# Altium schematic sheet Sheet1.SchDoc
size A; SheetNumber: 1; SheetTotal: 1
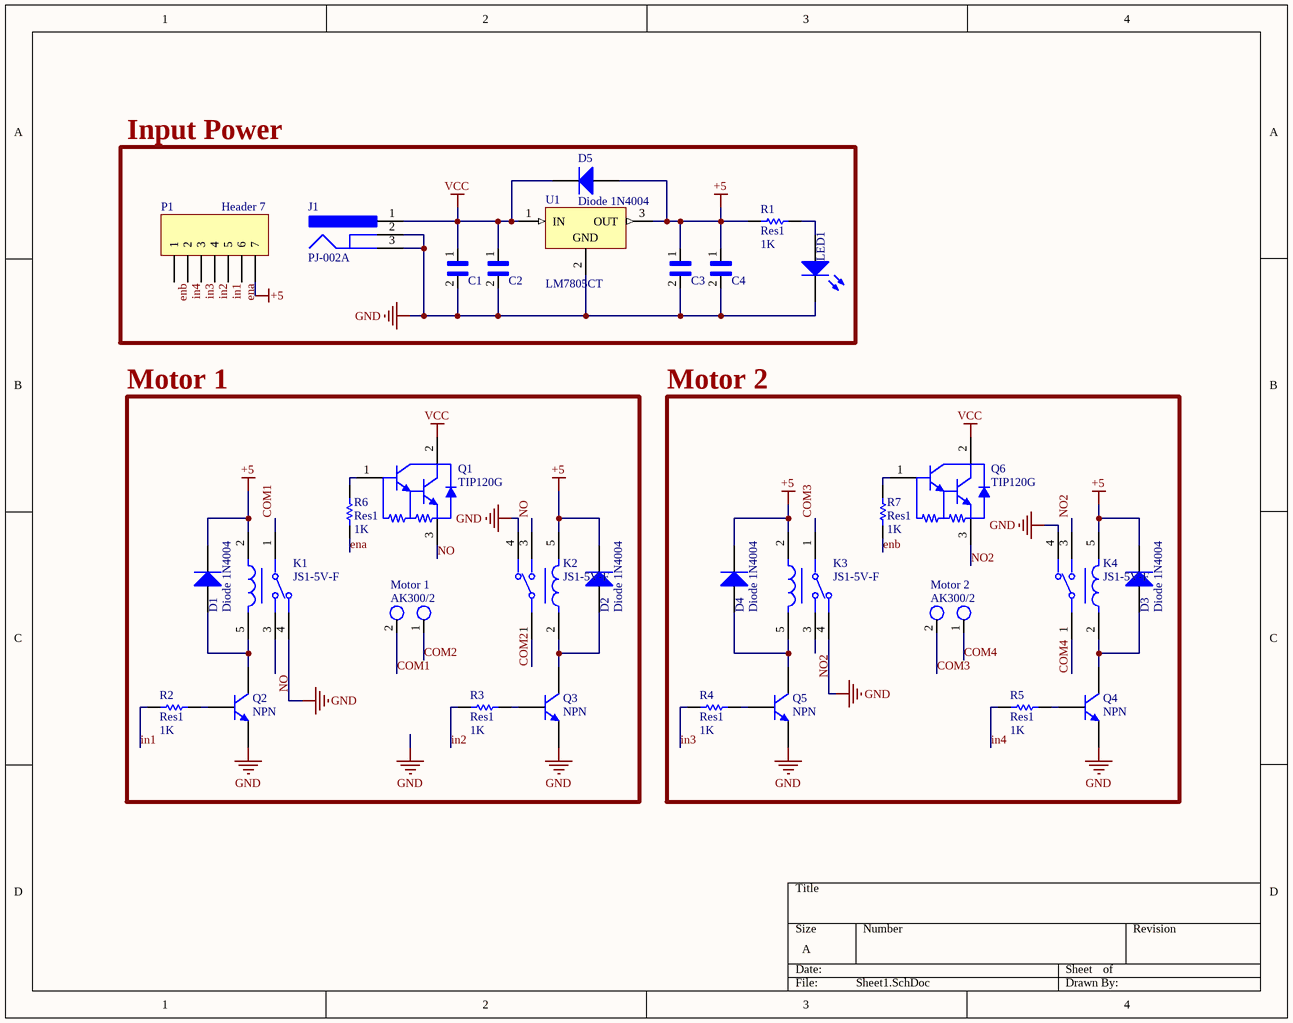
[diagram p0: Sheet1.SchDoc]

## Parts
C1  RDE5C2A220J0M1H03A  [CAP_RDE5C2A220J0M1H03A]  (value not drawn)
C2  RDE5C2A220J0M1H03A  [CAP_RDE5C2A220J0M1H03A]  (value not drawn)
C3  RDE5C2A220J0M1H03A  [CAP_RDE5C2A220J0M1H03A]  (value not drawn)
C4  RDE5C2A220J0M1H03A  [CAP_RDE5C2A220J0M1H03A]  (value not drawn)
D1  Diode 1N4004  [DO-41]
D2  Diode 1N4004  [DO-41]
D3  Diode 1N4004  [DO-41]
D4  Diode 1N4004  [DO-41]
D5  Diode 1N4004  [DO-41]
J1  PJ-002A  [CUI-PJ-002A_V]
K1  JS1-5V-F  [FP-JS1-5V-F-MFG]
K2  JS1-5V-F  [FP-JS1-5V-F-MFG]
K3  JS1-5V-F  [FP-JS1-5V-F-MFG]
K4  JS1-5V-F  [FP-JS1-5V-F-MFG]
LED1  151031SS06000  [Type 3mm]  (value not drawn)
Motor_1  AK300/2  [AK300/2]
Motor_2  AK300/2  [AK300/2]
P1  Header 7  [HDR1X7]
Q1  TIP120G  [ONSC-TO-220-3-221A-09]
Q2  NPN  [TO-226-AA]
Q3  NPN  [TO-226-AA]
Q4  NPN  [TO-226-AA]
Q5  NPN  [TO-226-AA]
Q6  TIP120G  [ONSC-TO-220-3-221A-09]
R1  Res1  value 1K  [AXIAL-0.3]
R2  Res1  value 1K  [AXIAL-0.3]
R3  Res1  value 1K  [AXIAL-0.3]
R4  Res1  value 1K  [AXIAL-0.3]
R5  Res1  value 1K  [AXIAL-0.3]
R6  Res1  value 1K  [AXIAL-0.3]
R7  Res1  value 1K  [AXIAL-0.3]
U1  LM7805CT  [FAIR-TO-220-3]

## Blocks framed on the sheet
Input Power: C1-C4 D5 J1 LED1 P1 R1 U1
Motor 1: D1 D2 K1 K2 Motor_1 Q1-Q3 R2 R3 R6
Motor 2: D3 D4 K3 K4 Motor_2 Q4-Q6 R4 R5 R7

## Nets
+5: C3.1 C4.1 D1.2(K) D2.2(K) D3.2(K) D4.2(K) D5.1(A) K1.2(1_COIL) K2.5(2_COIL) K3.2(1_COIL) K4.5(2_COIL) P1.7 R1.1 U1.3(OUT)
GND: C1.2 C2.2 C3.2 C4.2 J1.2 J1.3 K1.4(N.C.) K2.4(N.C.) K3.4(N.C.) K4.4(N.C.) LED1.1(K) Q2.3(E) Q3.3(E) Q4.3(E) Q5.3(E) U1.2(GND)
VCC: C1.1 C2.1 D5.2(K) J1.1 Q1.2(C) Q6.2(C) U1.1(IN)
COM1: K1.1(COM) Motor_1.2(KL)
COM2: K2.1(COM) Motor_1.1(KL)
COM3: K3.1(COM) Motor_2.2(KL)
COM4: K4.1(COM) Motor_2.1(KL)
ena: P1.6 R6.1
enb: P1.1 R7.1
in1: P1.5 R2.1
in2: P1.4 R3.1
in3: P1.3 R4.1
in4: P1.2 R5.1
NO: K1.3(N.O.) K2.3(N.O.) Q1.3(E)
NO2: K3.3(N.O.) K4.3(N.O.) Q6.3(E)
NetD1_1: D1.1(A) K1.5(2_COIL) Q2.1(C)
NetD2_1: D2.1(A) K2.2(1_COIL) Q3.1(C)
NetD3_1: D3.1(A) K4.2(1_COIL) Q4.1(C)
NetD4_1: D4.1(A) K3.5(2_COIL) Q5.1(C)
NetLED1_2: LED1.2(A) R1.2
NetQ1_1: Q1.1(B) R6.2
NetQ2_2: Q2.2(B) R2.2
NetQ3_2: Q3.2(B) R3.2
NetQ4_2: Q4.2(B) R5.2
NetQ5_2: Q5.2(B) R4.2
NetQ6_1: Q6.1(B) R7.2

## Library data of the parts
C1-C4 = RDE5C2A220J0M1H03A: Lead Capacitor C0G_EIA_ with Capacitance: 22pF and Rated Voltage: 100Vdc; MF: Murata; Availability: Unavailable; Price: None; Package: Radial Murata; Value: *; SnapEDA_Link: https://www.snapeda.com/parts/RDE5C2A220J0M1H03A/Murata/view-part/4545539/?ref=snap; MP: RDE5C2A220J0M1H03A
D1-D5 = Diode 1N4004: 1 Amp General Purpose Rectifier; Published: 8-Jun-2000; LatestRevisionDate: 17-Jul-2002; LatestRevisionNote: Re-released for DXP Platform.; DatasheetVersion: 1998; PackageVersion: Aug-1999; PackageReference: DO-41; Publisher: Altium Limited; PackageDescription: Diode, Axial; Body 5.2 x 2.7 mm (LxDia. max), Lead Dia. 0.86 mm (max); Code_JEDEC: DO-204-AL; ComponentLink1Description: Manufacturer Link; ComponentLink1URL: http://www.fairchildsemi.com/; ComponentLink2Description: Datasheet; ComponentLink2URL: http://www.fairchildsemi.com/ds/1N%2F1N4001.pdf
J1 = CMP-2000-06895-1: Through Hole Right Angle DC Power Jack, 2.5 A, 2 mm Center Pin, 3 Position, -25 to 85 degC, RoHS, Bulk; Manufacturer: CUIInc.; Current Rating: 2.5A; Inside Contact Diameter: 2mm; Insulation Resistance: 50MOhms; Outside Contact Diameter: 6.5mm; Voltage Rating: 24V; Brand: CUI; Operating Temperature Range: -25Cto+85C; Mounting Technology: ThroughHole; Connector Type: DCPowerJack; Contact Material: Copper; Datasheet URL: http://www.cui.com/product/resource/pj-002a.pdf; Contact Gender: Male; Housing Material: PolybutyleneTerephthalate(PBT); Manufacturer URL: http://www.cui.com/; Package Reference: PJ-002A; Mounting Style: ThroughHole; Mounting Angle: Right; Product Category: DCPowerConnectors; Product: Jacks; Flammability Rating: UL94V-0; Contact Plating: Nickel; RoHS: True; Datasheet Version: Rev. 1.03, 04/2016; Package Description: 3-Pin Through Hole Device, Body 14.4 x 9 mm, Height 11 mm; Factory Pack Quantity: 500; Termination Style: ThroughHole
K1-K4 = CMP-05606-000016-1: RELAY GEN PURPOSE SPDT 10A 5V; Manufacturer: Panasonic; Coil Type: Non-Latching; Number Of Contacts: 1; Standoff Height: 0.3mm; Switching Power: 150W; Coil Power: 360mW; Coil Current: 72mA; Coil Resistance: 69.4Ω; Lead Free: Yes; Device Class L3: Power Relays; Device Class L1: Electromechanical; Ambient Temperature Range High: +70°C; Temperature: -40°C to +70°C; Temperature Range High: +70°C; Temperature Range Low: -40°C; Manufacturer Part Number: JS1-5V-F; Coil Voltage: 5V; Switching Current: 10A; Digikey Description: RELAY GEN PURPOSE SPDT 10A 5V; Device Class L2: Relays; Ambient Temperature Range Low: -40°C; Throw Configuration: SPDT; Category: Relay; ComponentLink2URL: https://www3.panasonic.biz/ac/e_download/control/relay/power/catalog/mech_eng_js.pdf?via=ok; Package: JS1-5V-F; Octopart: https://octopart.com/js1-5v-f-panasonic-39428621; Mouser Description: JS Series 10 A SPDT 5 V Through Hole Sealed Miniature Non-Polarized Power Relay; Height: 16.8mm; ComponentLink2Description: Datasheet; RoHS: TRUE; Automotive: No
LED1 = CMP-1488-00002-1: THT LED round mono-color color lens, WL-TMRW, Super Red; Manufacturer: Wuerth Elektronik; ComponentLink2URL: http://katalog.we-online.de/pbs/datasheet/7448042001.pdfhttp://katalog.we-online.de/pbs/datasheet/7448042001.pdfhttp://katalog.we-online.de/pbs/datasheet/7448042001.pdfhttp://katalog.we-online.de/pbs/datasheet/151031SS06000.pdf; ComponentLink1URL: http://www.we-online.com; PartNumber: 151031SS06000; ComponentLink2Description: Datasheet; PackageReference: Type 3mm; Emitting color: Super Red; ComponentLink1Description: Manufacturer URL
Motor_1 Motor_2 = AK300/2: MP: AK300/3; MF: Altech; Package: None; Availability: Unavailable; SnapEDA_Link: https://www.snapeda.com/parts/AK300/3/Altech/view-part/2748485/?ref=snap; Check_prices: https://www.snapeda.com/parts/AK300/3/Altech/view-part/2748485/?ref=eda; Value: *; Price: None
P1 = Header 7: Header, 7-Pin; LatestRevisionDate: 17-Jul-2002; LatestRevisionNote: Re-released for DXP Platform.; Publisher: Altium Limited
Q1 Q6 = CMP-1047-00134-1: Plastic Medium-Power, Complementary Silicon Transistor, 3-Pin TO-220, Pb-Free, Tube; Manufacturer: On Semiconductor; Polarity: NPN; IC Continuous (A): 5; PackageDescription: 3-Pin Flange Mount, Vertical Straight Lead, Body 9.97 x 4.445 mm, Pitch 2.54 mm; PackageVersion: Rev. AG, 09/2011; ComponentLink2Description: Datasheet; DatasheetVersion: Rev. 8; Mounting Technology: Through Hole; ComponentLink1URL: http://www.onsemi.com/; RoHS: TRUE; ComponentLink3URL: http://www.onsemi.com/pub_link/Collateral/221A-09.PDF; ComponentLink3Description: Package Specification; ComponentLink1Description: Manufacturer URL; Packing: Tube; PackageReference: TO-220-3-221A-09; ComponentLink2URL: http://www.onsemi.cn/pub_link/Collateral/TIP120-D.PDF; PartNumber: TIP120G
Q2-Q5 = NPN: NPN Bipolar Transistor; Published: 8-Jun-2000; LatestRevisionDate: 17-Jul-2002; LatestRevisionNote: Re-released for DXP Platform.; PackageReference: TO-226-AA; Publisher: Altium Limited; PackageDescription: TO, Flat Index; 3 In-Line, Axial Leads; Body Dia. 4.8mm; Leads 0.55 x 0.51 mm (max); Code_JEDEC: TO-226-AA
R1-R7 = Res1: Resistor; Published: 8-Jun-2000; LatestRevisionDate: 17-Jul-2002; LatestRevisionNote: Re-released for DXP Platform.; PackageReference: AXIAL-0.3; Publisher: Altium Limited; PackageDescription: Axial Device, Thru-Hole; 2 Leads; 0.3 in Pin Spacing
U1 = CMP-2000-04938-1: Positive Voltage Regulator, 5 V, 1 A, -40 to 125 degC, 3-Pin TO-220, RoHS, Tube; Manufacturer: FairchildSemiconductor; Maximum Input Voltage: 35V; Maximum Quiescent Current: 8mA; Load Regulation: 100mV; Maximum Output Current: 2.2(Typ)A; Output Type: Fixed; Typical Dropout Voltage @ Current: 2@1AV; Rad Hard: No; Output Voltage: 5V; Accuracy: ±4%; Number of Outputs: 1; Category: LinearRegulator; Package Description: 3-Pin Through Hole Device, Body 10 x 4.5 mm, Pitch 2.54 mm; Packaging: Rail/Tube; Mounting: ThroughHole; Polarity: Positive; Manufacturer URL: https://www.fairchildsemi.com/; Line Regulation: 100mV; Datasheet Version: Aug-12; Datasheet URL: https://datasheet.ciiva.com/26904/lm7805ct-26904988.pdf; Package Reference: TO-220; Package URL: https://www.fairchildsemi.com/package-drawings/TO/TO220B03.pdf; Package: 3TO-220AB; Operating Temperature: -40to125degC; Type: Linear